# Altium schematic sheet DAUGHTERBOARD.SchDoc: DAUGHTERBOARD
size A3; DocumentNumber: 3; SheetNumber: 3; SheetTotal: 6
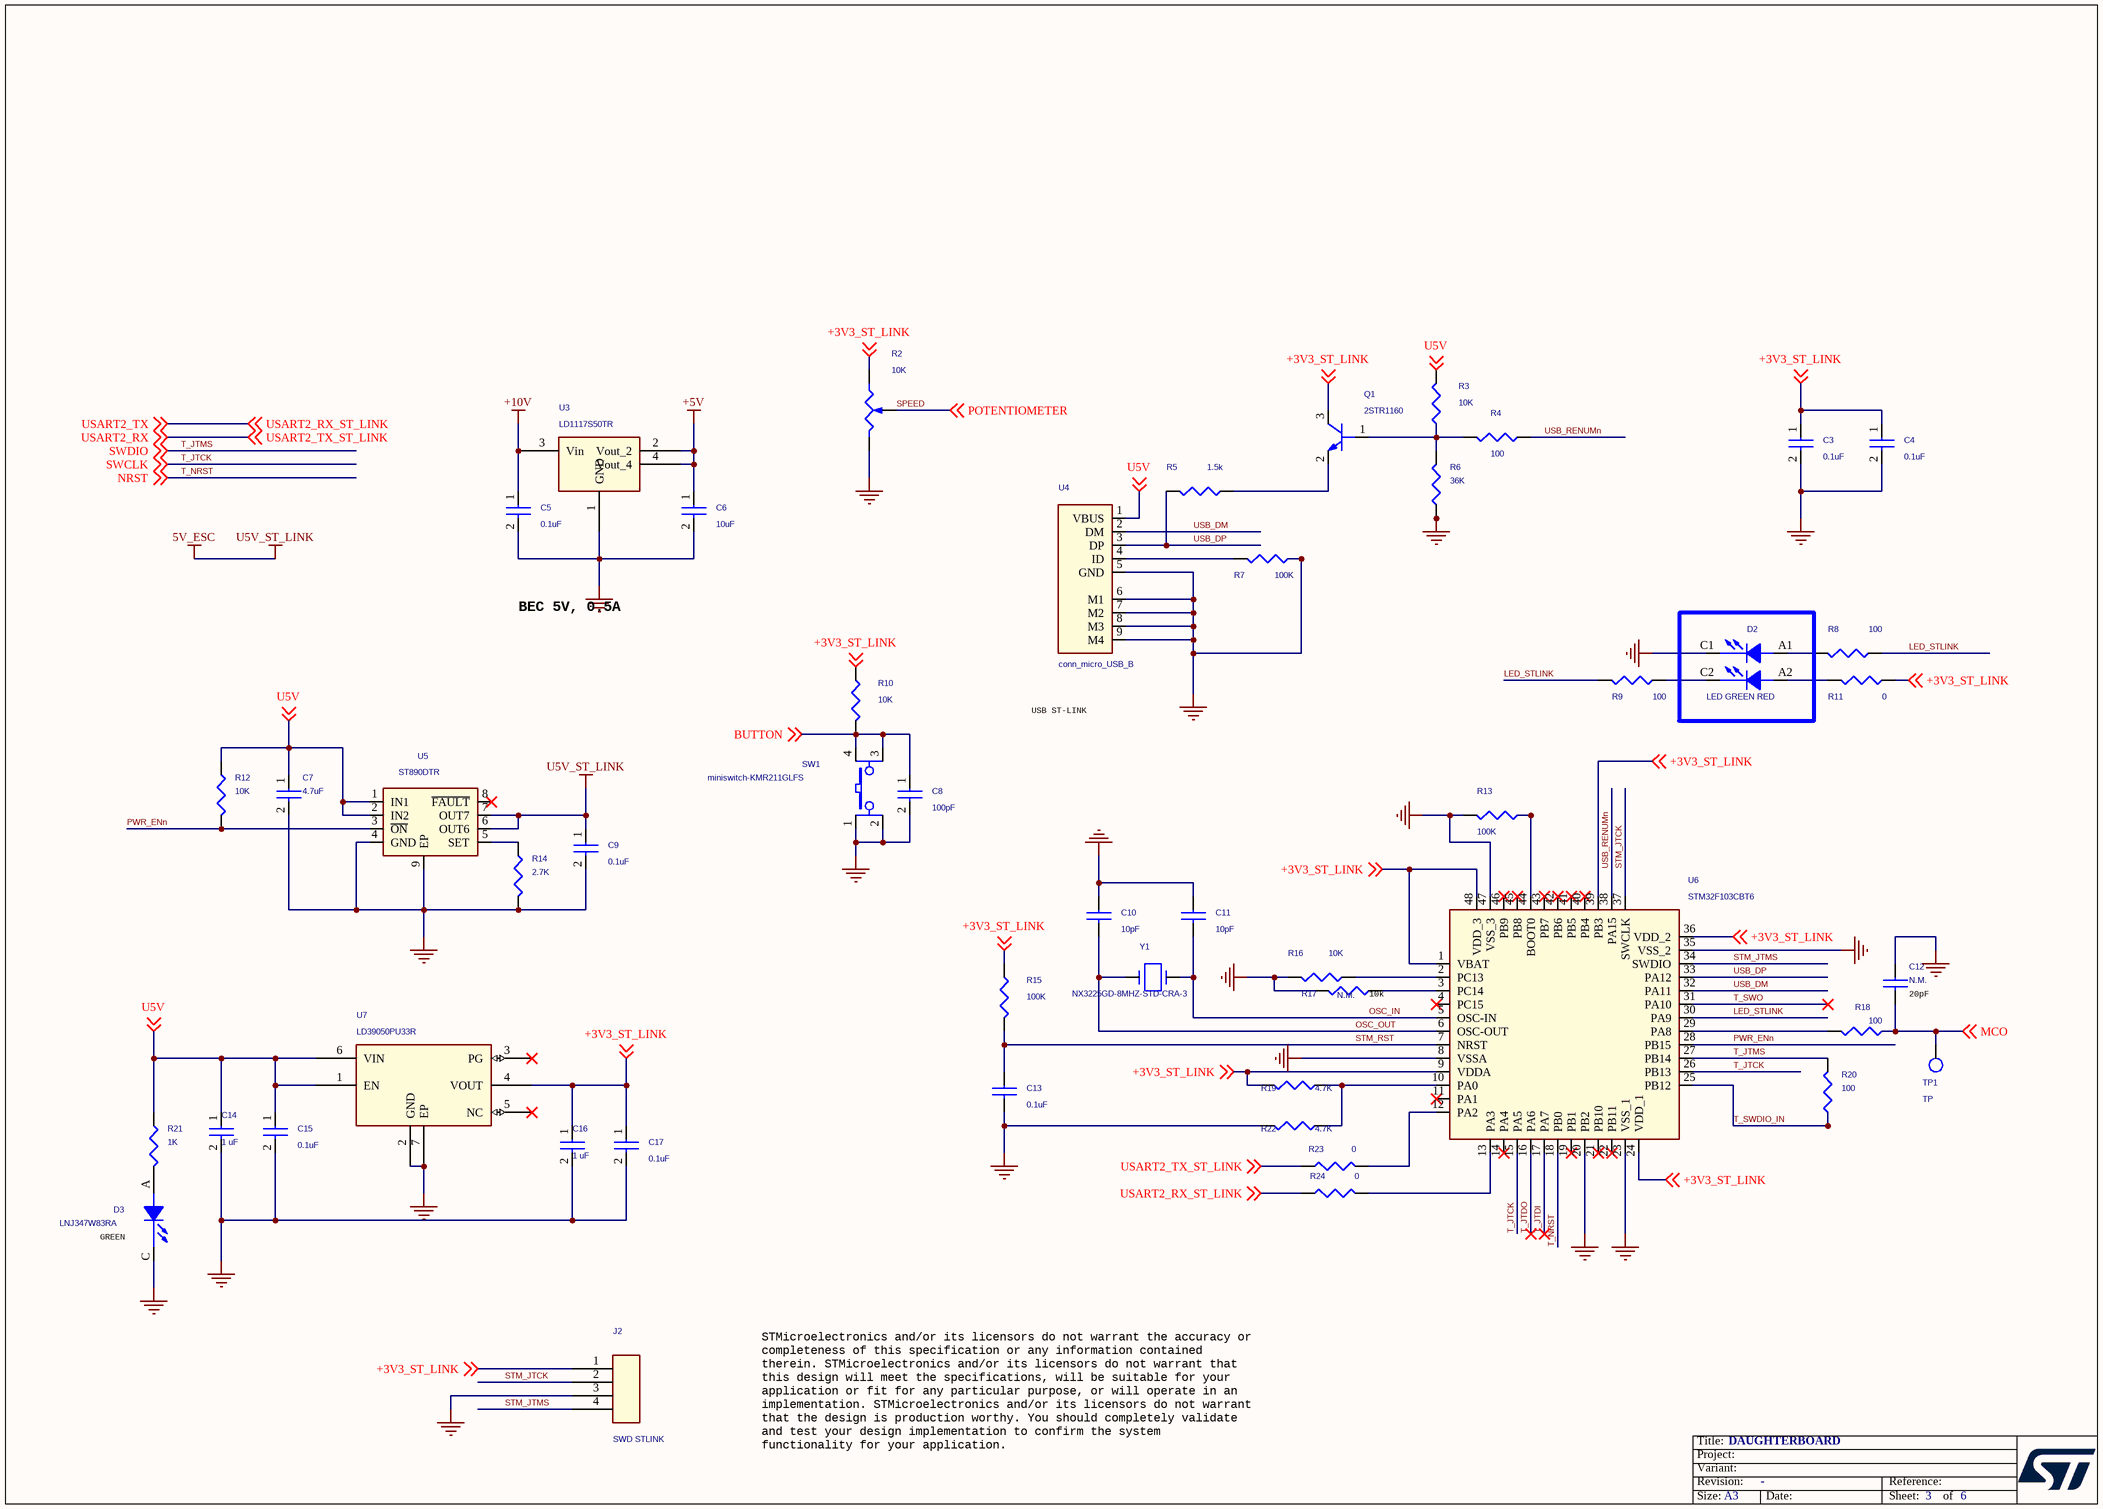
[diagram p0: DAUGHTERBOARD.SchDoc]

## Parts
C3  0.1uF  [C_0402]
C4  0.1uF  [C_0402]
C5  0.1uF  [C_0402]
C6  10uF  [C_0805]
C7  4.7uF  [C_0805]
C8  100pF  [C_0402]
C9  0.1uF  [C_0402]
C10  10pF  [C_0402]
C11  10pF  [C_0402]
C12  N.M.  [C_0402]
C13  0.1uF  [C_0402]
C14  1 uF  [C_0603]
C15  0.1uF  [C_0603]
C16  1 uF  [C_0603]
C17  0.1uF  [C_0402]
D2  LED GREEN RED  [Led_bicolor_3528-PLCC-4]
D3  LNJ347W83RA  [D_0402_Led_green]
J2  SWD STLINK  [strip4_100m_v]
Q1  2STR1160  [sot23-3p97_255x140l40x40n]
R2  10K  [trimmer-3386P_T]
R3  10K  [R_0402]
R4  100  [R_0402]
R5  1.5k  [R_0402]
R6  36K  [R_0402]
R7  100K  [R_0402]
R8  100  [R_0402]
R9  100  [R_0402]
R10  10K  [R_0402]
R11  0  [R_0402]
R12  10K  [R_0402]
R13  100K  [R_0402]
R14  2.7K  [R_0402]
R15  100K  [R_0402]
R16  10K  [R_0402]
R17  N.M.  [R_0402]
R18  100  [R_0402]
R19  4.7K  [R_0402]
R20  100  [R_0402]
R21  1K  [R_0402]
R22  4.7K  [R_0402]
R23  0  [JUMPER_0603_DROP]
R24  0  [JUMPER_0603_DROP]
SW1  miniswitch-KMR211GLFS  [switch_SMT_4_2x2_8mm]
TP1  TP  [test_point_100_smd]
U3  LD1117S50TR  [sot223-4p230_700x190l65x72]
U4  conn_micro_USB_B  [conn_micro_USB_B_SMD]
U5  ST890DTR  [son9p65_300x300x90l30x30t240-1]
U6  STM32F103CBT6  [qfp48p50_900x900x160l60x22n]
U7  LD39050PU33R  [son7p95_300x300x100l40x34t23-1]
Y1  NX3225GD-8MHZ-STD-CRA-3  [xtaldfn2_320x250x100l130x230]

## Nets
5V_ESC: C9.1 U5.6(OUT6) U5.7(OUT7)  [also labelled U5V_ST_LINK]
+5V: C6.1 U3.2(Vout_2) U3.4(Vout_4)
+10V: C5.1 U3.3(Vin)
GND: C3.2 C4.2 C5.2 C6.2 C7.2 C8.2 C9.2 C10.1 C11.1 C12.1 C13.2 C14.2 C15.2 C16.2 C17.2 D2.C1(CATHODE1) D3.C(CATHODE) J2.3 R2.1(A) R6.1 R7.1 R13.2 R14.2 R16.2 R17.2 R22.2 SW1.1 SW1.2 U3.1(GND) U4.5(GND) U4.6(M1) U4.7(M2) U4.8(M3) U4.9(M4) U5.4(GND) U5.9(EP) U6.8(VSSA) U6.20(PB2) U6.23(VSS_1) U6.35(VSS_2) U6.47(VSS_3) U7.2(GND) U7.7(EP)
+3V3_ST_LINK: C3.1 C4.1 C16.1 C17.1 J2.1 Q1.3(C) R2.3(B) R10.1 R11.1 R15.1 R19.2 U6.1(VBAT) U6.9(VDDA) U6.24(VDD_1) U6.36(VDD_2) U6.39(PB3) U6.48(VDD_3) U7.4(VOUT) ; off-sheet +3V3_ST_LINK
BUTTON: C8.1 R10.2 SW1.3 SW1.4 ; off-sheet BUTTON
LED_STLINK: R8.1 R9.2 U6.30(PA9)
MCO: C12.2 R18.1 TP1.1 ; off-sheet MCO
OSC_IN: C11.2 U6.5(OSC-IN) Y1.1
OSC_OUT: C10.2 U6.6(OSC-OUT) Y1.2
PWR_ENn: R12.2 U5.3(~{ON}) U6.28(PB15)
SPEED: R2.2(WIPER) ; off-sheet POTENTIOMETER  [also labelled POTENTIOMETER]
STM_JTCK: J2.2 U6.37(SWCLK)
STM_JTMS: J2.4 U6.34(SWDIO)
STM_RST: C13.1 R15.2 U6.7(NRST)
T_JTCK: U6.15(PA5) U6.26(PB13) ; off-sheet SWCLK  [also labelled SWCLK]
T_JTDI: U6.17(PA7)
T_JTDO: U6.16(PA6)
T_JTMS: R20.2 U6.27(PB14) ; off-sheet SWDIO  [also labelled SWDIO]
T_NRST: U6.18(PB0) ; off-sheet NRST  [also labelled NRST]
T_SWDIO_IN: R20.1 U6.25(PB12)
T_SWO: U6.31(PA10)
U5V: C7.1 C14.1 C15.1 R3.2 R12.1 R21.1 U4.1(VBUS) U5.1(IN1) U5.2(IN2) U7.1(EN) U7.6(VIN) ; off-sheet U5V
USART2_RX: R23.1 ; off-sheet USART2_TX_ST_LINK, off-sheet USART2_RX  [also labelled USART2_TX_ST_LINK]
USART2_RX_ST_LINK: R24.1 ; off-sheet USART2_RX_ST_LINK, off-sheet USART2_TX  [also labelled USART2_TX]
USB_DM: U4.2(DM) U6.32(PA11)
USB_DP: R5.2 U4.3(DP) U6.33(PA12)
USB_RENUMn: R4.1 U6.38(PA15)
NetD2_A1: D2.A1(ANODE1) R8.2
NetD2_A2: D2.A2(ANODE2) R11.2
NetD2_C2: D2.C2(CATHODE2) R9.1
NetD3_A: D3.A(ANODE) R21.2
NetQ1_1: Q1.1(B) R3.1 R4.2 R6.2
NetQ1_2: Q1.2(E) R5.1
NetR7_2: R7.2 U4.4(ID)
NetR13_1: R13.1 U6.44(BOOT0)
NetR14_1: R14.1 U5.5(SET)
NetR16_1: R16.1 U6.2(PC13)
NetR17_1: R17.1 U6.3(PC14)
NetR18_2: R18.2 U6.29(PA8)
NetR19_1: R19.1 R22.1 U6.10(PA0)
NetR23_2: R23.2 U6.12(PA2)
NetR24_2: R24.2 U6.13(PA3)

Not connected (* = marked no-connect by the designer): U5 8(~{FAULT})*; U6 4(PC15)* 11(PA1)* 14(PA4)* 19(PB1)* 21(PB10)* 22(PB11)* 40(PB4)* 41(PB5)* 42(PB6)* 43(PB7)* 45(PB8)* 46(PB9)*; U7 3(PG)* 5(NC)*

## Notes on the sheet
- BEC 5V, 0.5A
- USB ST-LINK
- (near R17) 10k
- (near C12) 20pF
- (near D3) GREEN
- STMicroelectronics and/or its licensors do not warrant the accuracy or
  completeness of this specification or any information contained
  therein. STMicroelectronics and/or its licensors do not warrant that
  this design will meet the specifications, will be suitable for your
  application or fit for any particular purpose, or will operate in an
  implementation. STMicroelectronics and/or its licensors do not warrant
  that the design is production worthy. You should completely validate
  and test your design implementation to confirm the system
  functionality for your application.
- Title:
- Project:
- Size:
- Revision:
- Variant:
- A3
- -
- Date:
- Reference:
- Sheet:
- of

## Library data of the parts
C3-C5 C9 = CAP_Dup1: CAP CER 0.1UF 16V X7R 0402; Manufacturer PN: 885012205037; Manufacturer: Wurth Electronics Inc.; PART_NUMBER: CAP-00000053; CLASS: DISCRETE; Tolerance: 10%; Dielectric Type: Capacitors; Rated Voltage: 16V; Temperature Coefficient: X7R; Package Size: 0402 (1005 Metric)
C6 = CAP_Dup1: CAP CER 10UF 16V X5R 0805; Manufacturer PN: 885012107014; Manufacturer: Wurth Electronics Inc.; PART_NUMBER: TMP-409; CLASS: DISCRETE; Tolerance: 20%; Dielectric Type: Capacitors; Rated Voltage: 16V; Temperature Coefficient: X5R; Package Size: 0805 (2012 Metric)
C7 = CAP_Dup1: CAP CER 4.7UF 16V X5R 0805; PART_NUMBER: TMP-410; Manufacturer: Wurth Electronics Inc.; Manufacturer PN: 885012107013; Dielectric Type: Capacitors; Tolerance: 20%; CLASS: DISCRETE; Package Size: 0805 (2012 Metric); Temperature Coefficient: X5R; Rated Voltage: 16V
C8 = CAP_Dup1: CAP CER 100PF 10V C0G/NP0 0402; PART_NUMBER: TMP-412; Manufacturer: Wurth Electronics Inc.; Manufacturer PN: 885012005013; Dielectric Type: Capacitors; Temperature Coefficient: C0G, NP0; Tolerance: 5%; CLASS: DISCRETE; Package Size: 0402 (1005 Metric); Rated Voltage: 10V
C10 C11 = CAP_7: CAP CER 10PF 10V C0G/NP0 0402; PART_NUMBER: TMP-395; Manufacturer: Wurth Electronics Inc.; Manufacturer PN: 885012005007; Dielectric Type: Capacitors; Temperature Coefficient: C0G, NP0; Tolerance: 5%; CLASS: DISCRETE; Package Size: 0402 (1005 Metric); Rated Voltage: 10V
C12 = CAP_6: CAP CER 0402-NOT MOUNTED; PART_NUMBER: TMP-408; CLASS: DISCRETE; Package Size: 0402 (1005 Metric)
C13 = CAP_8: CAP CER 0.1UF 16V X7R 0402; PART_NUMBER: CAP-00000053; Manufacturer: Wurth Electronics Inc.; Manufacturer PN: 885012205037; Dielectric Type: Capacitors; Tolerance: 10%; CLASS: DISCRETE; Package Size: 0402 (1005 Metric); Temperature Coefficient: X7R; Rated Voltage: 16V
C14 C16 = CAP_Dup1: CAP CER 1UF 16V X5R 0603; PART_NUMBER: TMP-302; Manufacturer: Yageo; Manufacturer PN: CC0603KRX5R7BB105; Dielectric Type: Capacitors; Tolerance: 10%; CLASS: DISCRETE; Package Size: 0603 (1608 Metric); Temperature Coefficient: X5R; Rated Voltage: 16V
C15 = CAP_Dup1: CAP CER 0.1UF 16V X7R 0603; Manufacturer PN: 885012206046; Manufacturer: Wurth Electronics Inc.; PART_NUMBER: CAP-00000052; CLASS: DISCRETE; Tolerance: 10%; Dielectric Type: Capacitors; Rated Voltage: 16V; Temperature Coefficient: X7R; Package Size: 0603 (1608 Metric)
C17 = CAP_Dup1: CAP CER 0.1UF 16V X7R 0402; PART_NUMBER: CAP-00000053; Manufacturer: Wurth Electronics Inc.; Manufacturer PN: 885012205037; Dielectric Type: Capacitors; Tolerance: 10%; CLASS: DISCRETE; Package Size: 0402 (1005 Metric); Temperature Coefficient: X7R; Rated Voltage: 16V
D2 = LED_BICOLOR: LED GREEN/RED CLEAR 4PLCC SMD; PART_NUMBER: TMP-705; Manufacturer: Wurth Electronics Inc.; Manufacturer PN: 150141RV73100; CLASS: DISCRETE; Package Size: 4-PLCC
D3 = LED: LED GREEN 0402 SMD; Manufacturer: Panasonic Electronic Components; PART_NUMBER: TMP-187; CLASS: DISCRETE; Manufacturer PN: LNJ347W83RA; Package Size: 0402 (1005 Metric)
J2 = CON4: SOLDER PADS
Q1 = BJT_NPN_BEC: TRANS NPN 60V 1A SOT-23; PART_NUMBER: TMP-433; Manufacturer: STMicroelectronics; CLASS: DISCRETE; Package Size: TO-236-3, SC-59, SOT-23-3; Polarity: NPN; Manufacturer PN: 2STR1160
R2 = POT: TRIMMER 10K OHM 0.5W PC PIN; PART_NUMBER: TMP-491; Manufacturer: Bourns Inc.; Manufacturer PN: 3386P-1-103TLF; Temperature Coefficient: 100ppm/C; Tolerance: 10%; Rated Power: 0.5W, 1/2W; CLASS: DISCRETE; Package Size: Square - 0.375" x 0.375" Face x 0.190" H (9.53mm x 9.53mm x 4.83mm)
R3 R12 = RES: RES SMD 10K OHM 1% 1/16W 0402; Manufacturer PN: RC0402FR-0710KL; Manufacturer: Yageo; PART_NUMBER: TMP-396; CLASS: DISCRETE; Rated Power: 0.063W, 1/16W; Temperature Coefficient: 100ppm/C; Tolerance: 1%; Package Size: 0402 (1005 Metric)
R4 R8 R20 = RES: RES SMD 100 OHM 1% 1/16W 0402; PART_NUMBER: TMP-406; Manufacturer: TE Connectivity Passive Product; Manufacturer PN: CRG0402F100R; Temperature Coefficient: 100ppm/C; Rated Power: 0.063W, 1/16W; CLASS: DISCRETE; Package Size: 0402 (1005 Metric); Tolerance: 1%
R5 = RES: RES SMD 1.5K OHM 1% 1/16W 0402; PART_NUMBER: TMP-393; Manufacturer: Yageo; Manufacturer PN: RC0402FR-071K5L; Temperature Coefficient: 100ppm/C; Rated Power: 0.063W, 1/16W; CLASS: DISCRETE; Package Size: 0402 (1005 Metric); Tolerance: 1%
R6 = RES: RES SMD 36K OHM 1% 1/16W 0402; Manufacturer PN: RC0402FR-0736KL; Manufacturer: Yageo; PART_NUMBER: TMP-436; CLASS: DISCRETE; Rated Power: 0.063W, 1/16W; Temperature Coefficient: 100ppm/C; Tolerance: 1%; Package Size: 0402 (1005 Metric)
R7 R13 = RES: RES SMD 100K OHM 1% 1/16W 0402; Manufacturer PN: CRG0402F100K; Manufacturer: TE Connectivity Passive Product; PART_NUMBER: TMP-405; CLASS: DISCRETE; Rated Power: 0.063W, 1/16W; Temperature Coefficient: 100ppm/C; Tolerance: 1%; Package Size: 0402 (1005 Metric)
R9 R18 = RES: RES SMD 100 OHM 1% 1/16W 0402; Manufacturer PN: CRG0402F100R; Manufacturer: TE Connectivity Passive Product; PART_NUMBER: TMP-406; CLASS: DISCRETE; Rated Power: 0.063W, 1/16W; Temperature Coefficient: 100ppm/C; Tolerance: 1%; Package Size: 0402 (1005 Metric)
R10 R16 = RES: RES SMD 10K OHM 1% 1/16W 0402; PART_NUMBER: TMP-396; Manufacturer: Yageo; Manufacturer PN: RC0402FR-0710KL; Temperature Coefficient: 100ppm/C; Rated Power: 0.063W, 1/16W; CLASS: DISCRETE; Package Size: 0402 (1005 Metric); Tolerance: 1%
R11 = RES: RES SMD 0 OHM JUMPER 1/16W 0402; Manufacturer PN: CRCW04020000Z0ED; Manufacturer: Vishay Dale; PART_NUMBER: RES-00000073; CLASS: DISCRETE; Rated Power: 0.063W, 1/16W; Tolerance: Jumper; Temperature Coefficient: -; Package Size: 0402 (1005 Metric)
R14 = RES: RES SMD 2.7K OHM 1% 1/16W 0402; PART_NUMBER: TMP-411; Manufacturer: Yageo; Manufacturer PN: RC0402FR-072K7L; Temperature Coefficient: 100ppm/C; Rated Power: 0.063W, 1/16W; CLASS: DISCRETE; Package Size: 0402 (1005 Metric); Tolerance: 1%
R15 = RES: RES SMD 100K OHM 1% 1/16W 0402; PART_NUMBER: TMP-405; Manufacturer: TE Connectivity Passive Product; Manufacturer PN: CRG0402F100K; Temperature Coefficient: 100ppm/C; Rated Power: 0.063W, 1/16W; CLASS: DISCRETE; Package Size: 0402 (1005 Metric); Tolerance: 1%
R17 = RES: RES SMD 0402 - NOT MOUNTED; PART_NUMBER: TMP-404; CLASS: DISCRETE; Package Size: 0402 (1005 Metric)
R19 R22 = RES: RES SMD 4.7K OHM 1% 1/16W 0402; PART_NUMBER: TMP-403; Manufacturer: TE Connectivity Passive Product; Manufacturer PN: CRG0402F4K7; Temperature Coefficient: 100ppm/C; Rated Power: 0.063W, 1/16W; CLASS: DISCRETE; Package Size: 0402 (1005 Metric); Tolerance: 1%
R21 = RES: RES SMD 1K OHM 1% 1/16W 0402; PART_NUMBER: TMP-352; Manufacturer: Yageo; Manufacturer PN: RC0402FR-071KL; Temperature Coefficient: 100ppm/C; Rated Power: 0.063W, 1/16W; CLASS: DISCRETE; ALT_SYMBOLS: r_0402_hd; Package Size: 0402 (1005 Metric); Tolerance: 1%
R23 = RES: RES SMD 0 OHM JUMPER 1/10W 0603; Manufacturer PN: ERJ-3GEY0R00V; Manufacturer: Panasonic Electronic Components; PART_NUMBER: RES-00000056; CLASS: DISCRETE; Rated Power: 0.1W, 1/10W; Tolerance: Jumper; Temperature Coefficient: -; Package Size: 0603 (1608 Metric)
R24 = RES: RES SMD 0 OHM JUMPER 1/10W 0603; PART_NUMBER: RES-00000056; Manufacturer: Panasonic Electronic Components; Manufacturer PN: ERJ-3GEY0R00V; Rated Power: 0.1W, 1/10W; CLASS: DISCRETE; Package Size: 0603 (1608 Metric); Temperature Coefficient: -; Tolerance: Jumper
SW1 = PUSHBUTTON-SPST-2: SWITCH TACTILE SPST-NO 0.05A 32V; Manufacturer: C&K; PART_NUMBER: TMP-285; CLASS: DISCRETE; Manufacturer PN: KMR211GLFS; Package Size: 4.60mm x 2.80mm
TP1 = TESTPOINT: TEST POINT 1MM  SMD PADSTASCK; PART_NUMBER: TMP-386; CLASS: IO
U3 = LD1117SxxxTR_0: IC REG LINEAR 5V 800MA SOT223; Manufacturer: STMicroelectronics; PART_NUMBER: TMP-381; Manufacturer PN: LD1117S50TR; CLASS: IC; Package Size: TO-261-4, TO-261AA
U4 = USB_MICRO: CONN RCPT 5POS MICRO USB R/A; Manufacturer PN: 0473460001; Manufacturer: Molex, LLC; PART_NUMBER: TMP-434; CLASS: IO
U5 = ST890DTR: IC PWR SWITCH 1.2A HISIDE 8-DFN; Manufacturer: STMicroelectronics; PART_NUMBER: TMP-432; Supply Voltage: Not Required; Manufacturer PN: ST890DTR; CLASS: IC; Package Size: 8-VDFN Exposed Pad
U6 = STM32F103CBT6: IC MCU 32BIT 128KB FLASH 48LQFP; PART_NUMBER: TMP-399; Manufacturer: STMicroelectronics; Supply Voltage: 2 V ~ 3.6 V; Package Size: 48-LQFP; CLASS: IC; Manufacturer PN: STM32F103CBT6
U7 = LD39050PU33R: IC REG LINEAR 3.3V 500MA 6DFN; PART_NUMBER: TMP-358; Manufacturer: STMicroelectronics; Package Size: 6-VDFN Exposed Pad; CLASS: IC; Manufacturer PN: LD39050PU33R
Y1 = crystal: CRYSTAL 8.0000MHZ 8PF SMD; Manufacturer: NDK America, Inc.; PART_NUMBER: TMP-435; CLASS: DISCRETE; Frequency Tolerance: 50ppm; Frequency Stability: 150ppm; Manufacturer PN: NX3225GD-8MHZ-STD-CRA-3; Package Size: 0.126" L x 0.098" W (3.20mm x 2.50mm)